# Altium schematic sheet Sheet2.SchDoc
size A4
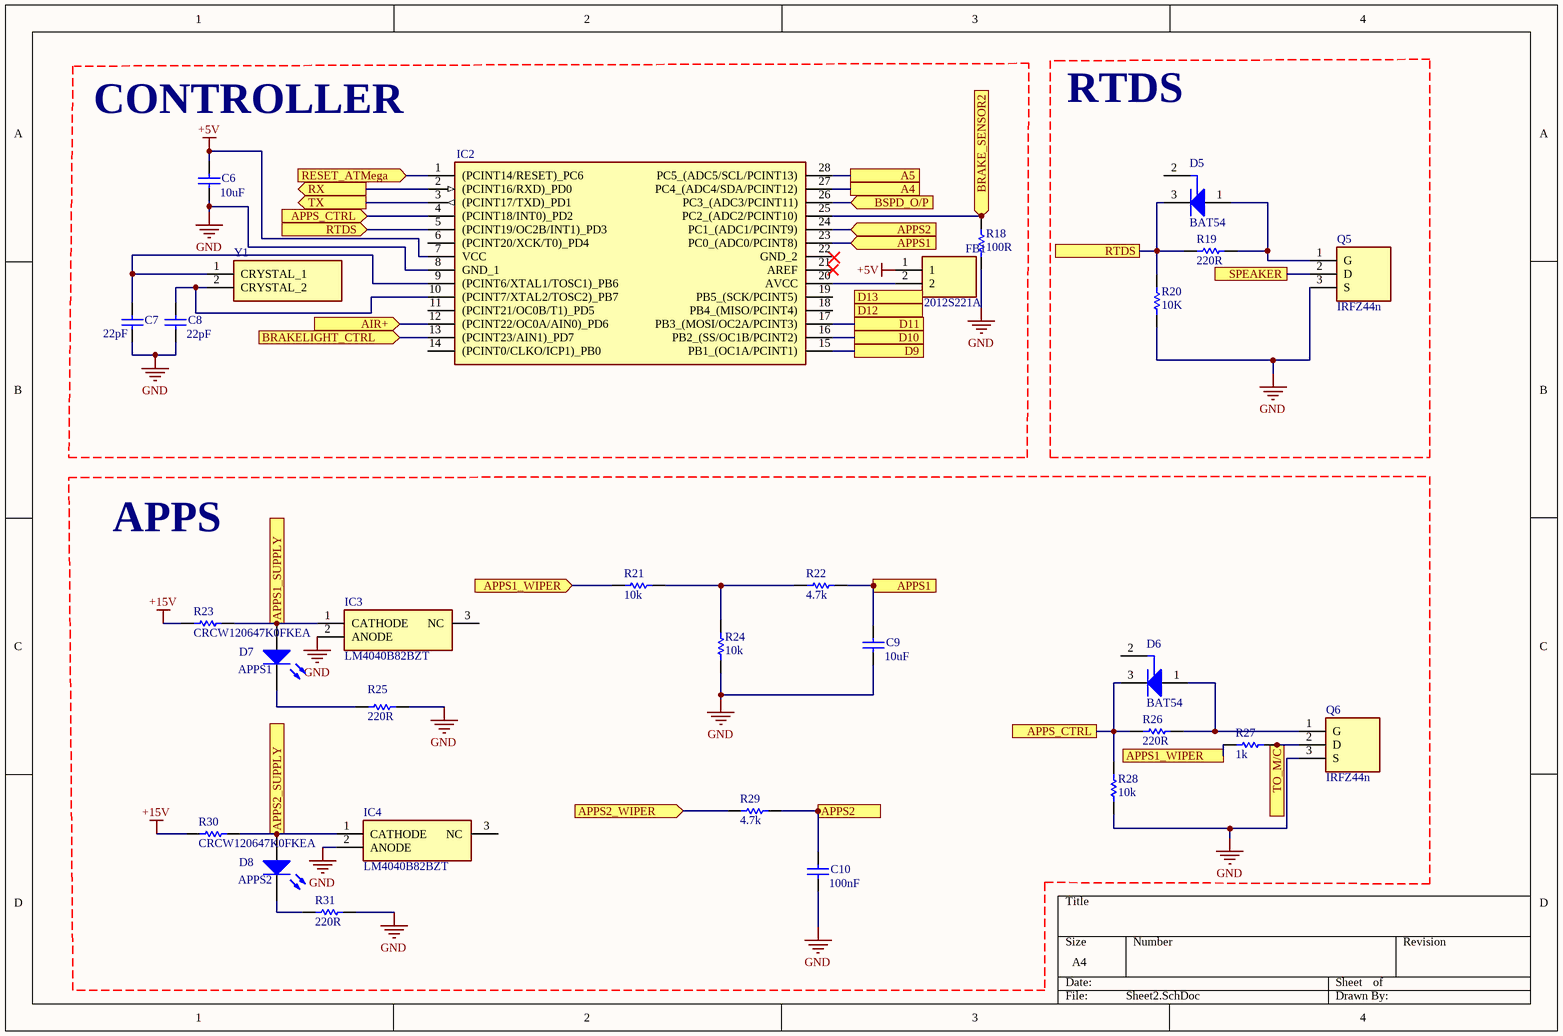
[diagram p0: Sheet2.SchDoc]

## Parts
C6  10uF  [KEMT-1206-2_N]
C7  22pF  [KEMT-1206-2_N]
C8  22pF  [KEMT-1206-2_N]
C9  10uF  [KEMT-1206-2_N]
C10  100nF  [KEMT-1206-2_N]
D5  BAT54  [INF-SOT23_N]
D6  BAT54  [INF-SOT23_N]
D7  APPS1  [3.2X1.6X1.1]
D8  APPS2  [3.2X1.6X1.1]
FB1  MPZ2012S221A  [BEADC2012X105N]
IC2  ATMEGA328-PU  [DIP1016W53P254L3468H457Q28N]  (value not drawn)
IC3  LM4040B82BZT  [SOT95P237X112-3N]
IC4  LM4040B82BZT  [SOT95P237X112-3N]
Q5  IRFZ44n  [TO254P483X1016X2223-3P]
Q6  IRFZ44n  [TO254P483X1016X2223-3P]
R18  100R  [R1206]
R19  220R  [R1206]
R20  10K  [R1206]
R21  10k  [R1206]
R22  4.7k  [R1206]
R23  CRCW120647K0FKEA  [R1206]
R24  10k  [R1206]
R25  220R  [R1206]
R26  220R  [R1206]
R27  1k  [R1206]
R28  10k  [R1206]
R29  4.7k  [R1206]
R30  CRCW120647K0FKEA  [R1206]
R31  220R  [R1206]
Y1  ECS-160-18-4X-CKM  [ECS160184XCKM]  (value not drawn)

## Blocks framed on the sheet
CONTROLLER: C6-C8 FB1 IC2 R18 Y1
APPS: C9 C10 D6-D8 IC3 IC4 Q6 R21-R31

## Ports
A4, A5, AIR+ (in), APPS1, APPS1 (in), APPS1_SUPPLY (out), APPS1_WIPER, APPS1_WIPER (in), APPS2, APPS2 (in), APPS2_SUPPLY (out), APPS2_WIPER (in), APPS_CTRL, APPS_CTRL (in), BRAKE_SENSOR2 (in), BRAKELIGHT_CTRL (in), BSPD_O/P (in), D9, D10, D11, D12, D13, RESET_ATMega (in), RTDS, RTDS (in), RX (out), SPEAKER, TO_M/C, TX (out)

## Nets
+5V: C6.2 FB1.1 IC2.7(VCC)
+15V: R23.1 R30.1
GND: C6.1 C7.1 C8.1 C9.1 C10.1 IC2.8(GND_1) IC3.2(ANODE) IC4.2(ANODE) Q5.3(S) Q6.3(S) R18.1 R20.1 R24.1 R25.2 R28.1 R31.2
A4: IC2.27(PC4_(ADC4/SDA/PCINT12)) ; port A4
A5: IC2.28(PC5_(ADC5/SCL/PCINT13)) ; port A5
AIR+: IC2.12((PCINT22/OC0A/AIN0)_PD6) ; port AIR+
APPS1: C9.2 IC2.23(PC0_(ADC0/PCINT8)) R22.2 ; port APPS1
APPS1_SUPPLY: D7.1(A) IC3.1(CATHODE) R23.2 ; port APPS1_SUPPLY
APPS1_WIPER: R21.1 R27.2 ; port APPS1_WIPER
APPS2: C10.2 IC2.24(PC1_(ADC1/PCINT9)) R29.2 ; port APPS2
APPS2_SUPPLY: D8.1(A) IC4.1(CATHODE) R30.2 ; port APPS2_SUPPLY
APPS2_WIPER: R29.1 ; port APPS2_WIPER
APPS_CTRL: D6.3(K) IC2.4((PCINT18/INT0)_PD2) R26.1 R28.2 ; port APPS_CTRL
BRAKE_SENSOR2: IC2.25(PC2_(ADC2/PCINT10)) R18.2 ; port BRAKE_SENSOR2
BRAKELIGHT_CTRL: IC2.13((PCINT23/AIN1)_PD7) ; port BRAKELIGHT_CTRL
BSPD_O/P: IC2.26(PC3_(ADC3/PCINT11)) ; port BSPD_O/P
D9: IC2.15(PB1_(OC1A/PCINT1)) ; port D9
D10: IC2.16(PB2_(SS/OC1B/PCINT2)) ; port D10
D11: IC2.17(PB3_(MOSI/OC2A/PCINT3)) ; port D11
RESET_ATMega: IC2.1((PCINT14/RESET)_PC6) ; port RESET_ATMega
RTDS: D5.3(K) IC2.5((PCINT19/OC2B/INT1)_PD3) R19.1 R20.2 ; port RTDS
RX: IC2.2((PCINT16/RXD)_PD0) ; port RX
SPEAKER: Q5.2(D) ; port SPEAKER
TO_M/C: Q6.2(D) R27.1 ; port TO_M/C
TX: IC2.3((PCINT17/TXD)_PD1) ; port TX
NetC7_2: C7.2 IC2.9((PCINT6/XTAL1/TOSC1)_PB6) Y1.1(CRYSTAL_1)
NetC8_2: C8.2 IC2.10((PCINT7/XTAL2/TOSC2)_PB7) Y1.2(CRYSTAL_2)
NetD5_1: D5.1(A) Q5.1(G) R19.2
NetD6_1: D6.1(A) Q6.1(G) R26.2
NetD7_2: D7.2(K) R25.1
NetD8_2: D8.2(K) R31.1
NetFB1_2: FB1.2 IC2.20(AVCC)
NetR21_2: R21.2 R22.1 R24.2

Not connected (* = marked no-connect by the designer): D5 2(NC); D6 2(NC); IC2 6((PCINT20/XCK/T0)_PD4) 11((PCINT21/OC0B/T1)_PD5) 14((PCINT0/CLKO/ICP1)_PB0) 18(PB4_(MISO/PCINT4)) 19(PB5_(SCK/PCINT5)) 21(AREF)* 22(GND_2); IC3 3(NC); IC4 3(NC)

## Notes on the sheet
- RTDS

## Library data of the parts
C6-C10 = CMP-1037-04202-2: CAP, Ceramic, 0.1 uF, +/- 10%, 50 V, -55 to 125 degC, 1206 (3216 Metric), RoHS, Tape and Reel; Manufacturer: Kemet; Voltage Rating: 50V; Capacitance: 0.1µF; Product Range: KEMET-CSeries; SVHC: ToBeAdvised; Dielectric Characteristic: X7R; Capacitor Case Style: 1206[3216Metric]; Package Reference: 1206-2; Package Description: 2-Leads SMD, Body 3.2 x 1.6 mm; Packaging: Tape&Reel; Operating Temperature Max: 125degC; Capacitance Tolerance: ±10%; Datasheet URL: https://datasheet.ciiva.com/6125/1725438-6125494.pdf; Manufacturer URL: http://www.kemet.com/; Operating Temperature Min: -55degC; Datasheet Version: Jul-13
D5 D6 = CMP-1182-00010-1: Silicon Schottky Diode, SOT23, Reel, Green; Manufacturer: Infineon; VF (max): 800Â mV; Configuration: Single; IF (max): 200Â mA; CT (max): 10Â pF; Green: TRUE; VR (max): 30Â V; PartNumber: BAT54; ComponentLink2URL: http://www.infineon.com/dgdl/bat54series.pdf?folderId=db3a30431400ef68011425f1ca2505e3&fileId=db3a304314dca3890115190b74210ea6; ComponentLink3Description: Package Specification; PackageVersion: Apr-08; PackageDescription: 3-Pin Small Outline Transistor Package, 1.3 x 2.9 mm Body, 0.95 mm Pitch; ComponentLink1Description: Manufacturer URL; ComponentLink1URL: http://www.infineon.com/; Mounting Technology: Surface Mount; Packing: Reel; ComponentLink2Description: Datasheet; PackageReference: SOT23; ComponentLink3URL: http://www.infineon.com/dgdl/SOT23-Package_Overview.pdf?folderId=db3a30431936bc4b0119532290053c66&fileId=db3a30431936bc4b0119533468123c85
D7 D8 = LED2: Typical RED, GREEN, YELLOW, AMBER GaAs LED; Published: 8-Jun-2000; LatestRevisionDate: 17-Jul-2002; LatestRevisionNote: Re-released for DXP Platform.; PackageVersion: Feb-2002; PackageReference: 3.2X1.6X1.1; Publisher: Altium Limited; PackageDescription: SM LED; 2 Flat Leads
FB1 = MPZ2012S221A: Ferrite Bead; Manufacturer_Name: TDK; Datasheet Link: https://product.tdk.com/info/en/catalog/datasheets/beads_commercial_power_mpz2012_en.pdf; Height: 1.05mm; Manufacturer_Part_Number: MPZ2012S221A; Mouser Part Number: 810-MPZ2012S221A; Mouser Price/Stock: https://www.mouser.co.uk/ProductDetail/TDK/MPZ2012S221A?qs=g8DL0B6GkTmmIcDMLnw6hw%3D%3D
IC2 = ATMEGA328-PU: Integrated Circuit; Manufacturer_Name: Microchip; Datasheet Link: https://componentsearchengine.com/Datasheets/1/ATMEGA328-PU.pdf; Height: 4.572mm; Manufacturer_Part_Number: ATMEGA328-PU; Mouser Part Number: 556-ATMEGA328-PU; Mouser Price/Stock: https://www.mouser.co.uk/ProductDetail/Microchip-Technology-Atmel/ATMEGA328-PU?qs=lwdSMh1%2FoYJT8tfItQpQtA%3D%3D; Arrow Part Number: ATMEGA328-PU; Arrow Price/Stock: https://www.arrow.com/en/products/atmega328-pu/microchip-technology
IC3 IC4 = LM4040B25IDBZT: Integrated Circuit; Manufacturer_Name: Texas Instruments; Datasheet Link: https://www.ti.com/lit/gpn/LM4040; Height: 1.12mm; Manufacturer_Part_Number: LM4040B25IDBZT; Mouser Part Number: 595-LM4040B25IDBZT; Mouser Price/Stock: https://www.mouser.com/Search/Refine.aspx?Keyword=595-LM4040B25IDBZT; Arrow Part Number: LM4040B25IDBZT; Arrow Price/Stock: https://www.arrow.com/en/products/lm4040b25idbzt/texas-instruments
Q5 Q6 = IRFZ44n: Transistor; Manufacturer_Name: Infineon; Datasheet Link: http://www.irf.com/product-info/datasheets/data/irfz44n.pdf; Height: 4.83mm; Manufacturer_Part_Number: IRFZ44n
R18-R22 R24 R26-R29 R31 = RES: Part Number: CRCW120647K0FKEA; Manufacturer: Vishay Dale
R23 R30 = RES: Manufacturer: Vishay Dale; Part Number: CRCW120647K0FKEA
R25 = CMP-2003-02213-1: Part Number: CRCW120647K0FKEA; Manufacturer: Vishay Dale
Y1 = ECS-160-18-4X-CKM: Crystal or Oscillator; Manufacturer_Name: ECS; Datasheet Link: https://www.mouser.be/datasheet/2/122/hc-49usx-791.pdf; Height: 3.5mm; Manufacturer_Part_Number: ECS-160-18-4X-CKM; Mouser Part Number: 520-ECS160-18-4X-CKM; Mouser Price/Stock: https://www.mouser.co.uk/ProductDetail/ECS/ECS-160-18-4X-CKM?qs=7MVldsJ5UawYqyimirccKw%3D%3D